# EAGLE design AirU_PoE_V2 (EAGLE 9.5.2)
COMPANY: ADAFRUIT INDUSTRIES; DRAWN: KTOWN; REV: B
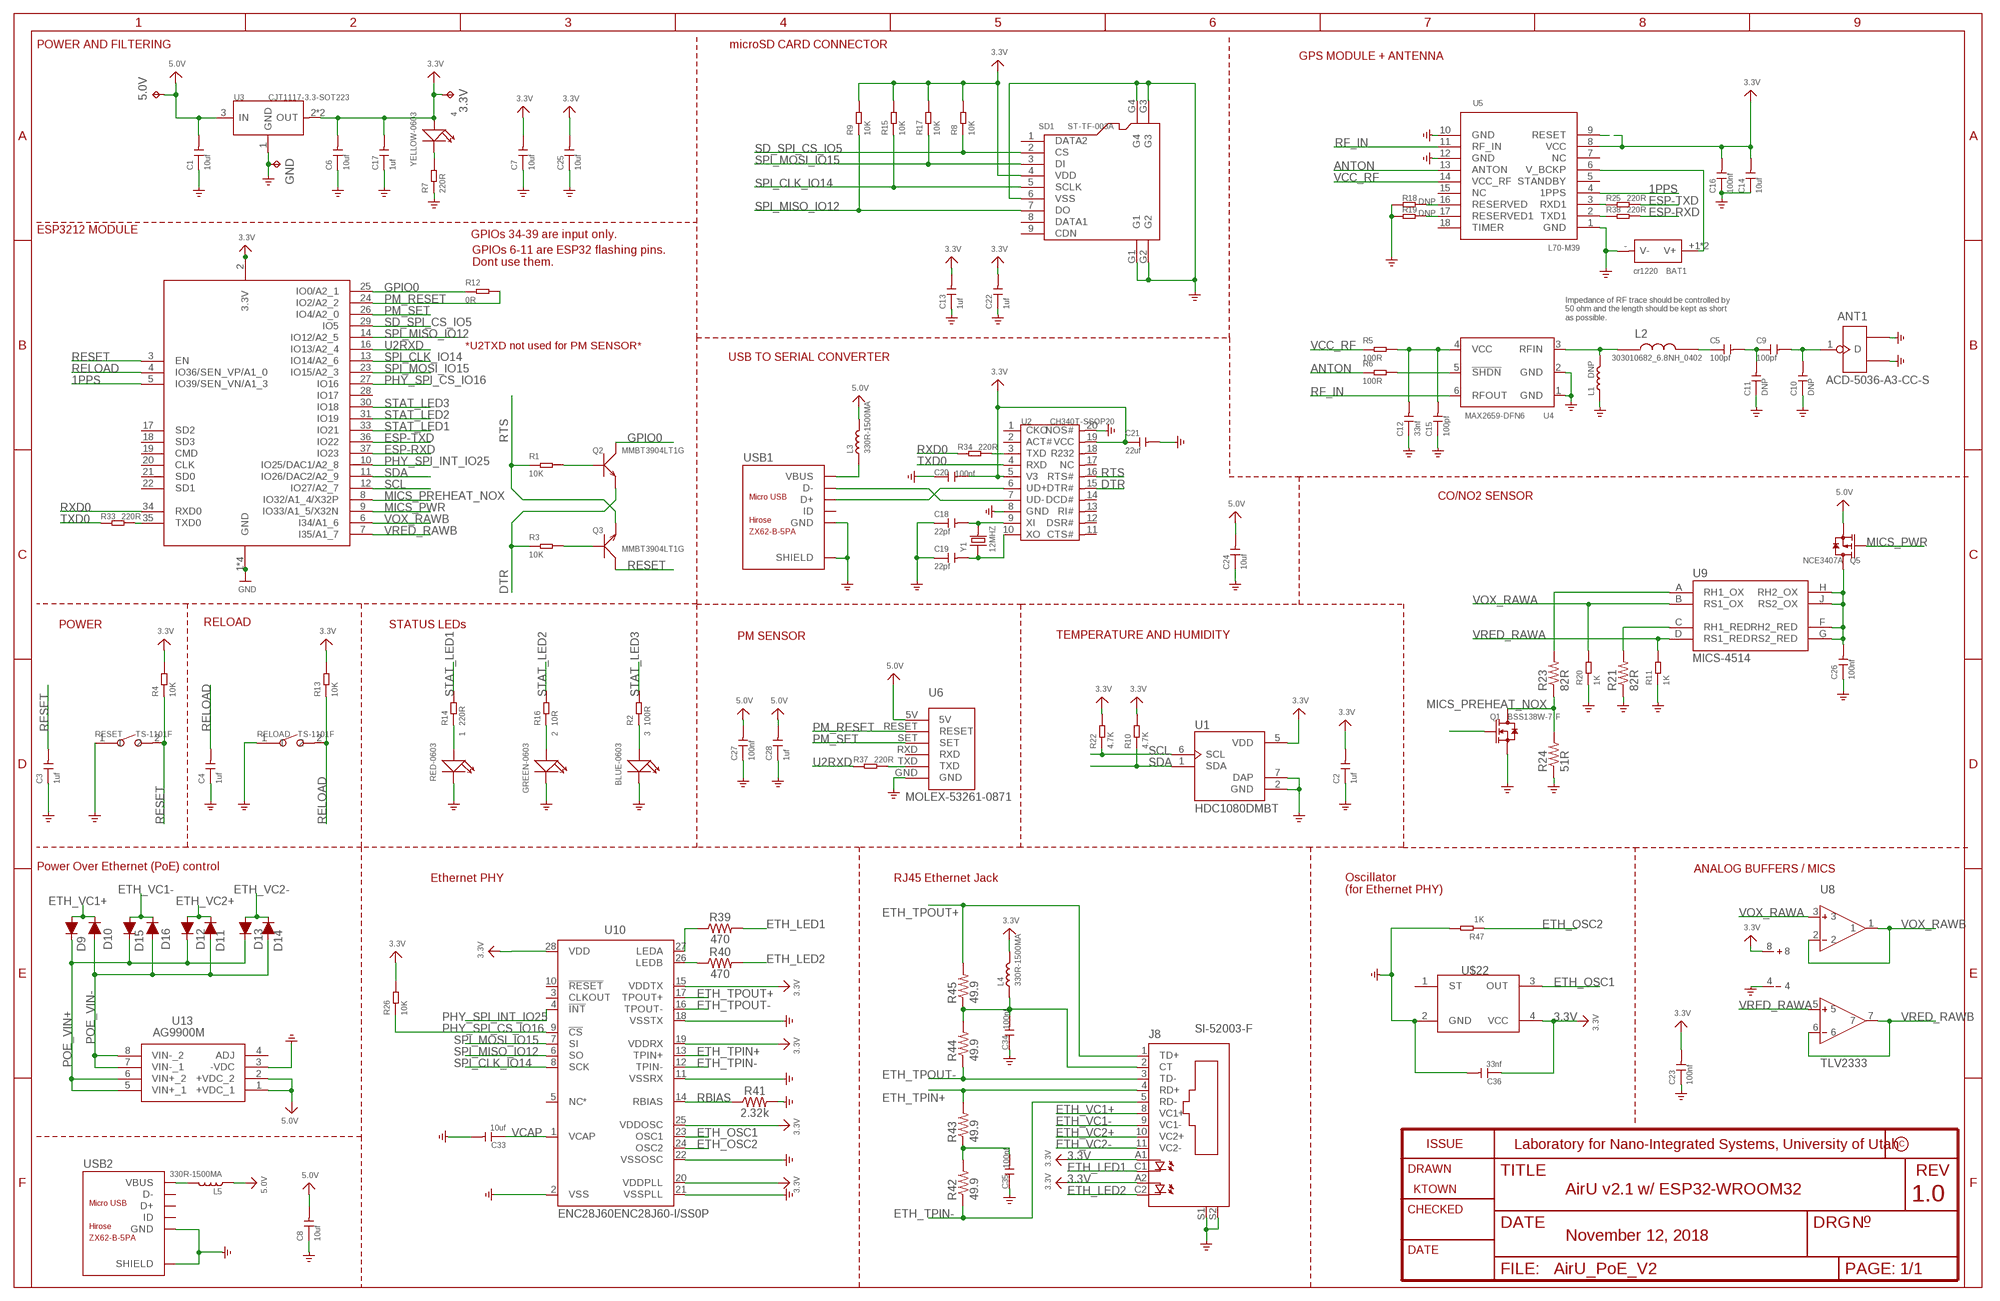
[diagram p0: schematic, sheet 1]
FRAME1 (FRAME_A4): COMPANY: TETRAD: SENSOR NETWORK SOLUTIONS, LLC; REV: 1.0

## Parts
1  RED-0603  LED-SMD-RED-DIFFUSED(0603)  [LED-0603]
2  GREEN-0603  SMD-LED-CLEAR-GREEN(0603)  [LED-0603]
3  BLUE-0603  SMD-LED-CLEAR-BLUE(0603)  [LED-0603]
3.3V  TPTP20SQ  [TP20SQ]
4  YELLOW-0603  SMD-LED-CLEAR-YELLOW(0603)  [LED-0603]
5.0V  TPTP20SQ  [TP20SQ]
ANT1  ACD-5036-A3-CC-S  ANTENNA-ACD5036  [ANT3-SMD-5.2X3.7X0.7MM]
BAT1  cr1220  DIP-BATTERY-CELL-HOLDER(1220)  [BAT2P-13.5-CR1220]
C1  10uf  CERAMIC-10UF-10V-10%-X5R(0603)  [C0603]
C2  1uf  CERAMIC-1UF-25V-10%-X7R(0603)  [C0603]
C3  1uf  CERAMIC-1UF-25V-10%-X7R(0603)  [C0603]
C4  1uf  CERAMIC-1UF-25V-10%-X7R(0603)  [C0603]
C5  100pf  CERAMIC-100PF-50V-5%-NPO(0603)  [C0603]
C6  10uf  CERAMIC-10UF-10V-10%-X5R(0603)  [C0603]
C7  10uf  CERAMIC-10UF-10V-10%-X5R(0603)  [C0603]
C8  10uf  CERAMIC-10UF-10V-10%-X5R(0603)  [C0603]
C9  100pf  CERAMIC-100PF-50V-5%-NPO(0603)  [C0603]
C10  DNP  CERAMIC-100PF-50V-5%-NPO(0603)  [C0603]
C11  DNP  CERAMIC-100PF-50V-5%-NPO(0603)  [C0603]
C12  33nf  CERAMIC-33NF-50V-10%-X7R(0603)  [C0603]
C13  1uf  CERAMIC-1UF-25V-10%-X7R(0603)  [C0603]
C14  10uf  CERAMIC-10UF-10V-10%-X5R(0603)  [C0603]
C15  100pf  CERAMIC-100PF-50V-5%-NPO(0603)  [C0603]
C16  100nf  CERAMIC-100NF-50V-10%-X7R(0603)  [C0603]
C17  1uf  CERAMIC-1UF-25V-10%-X7R(0603)  [C0603]
C18  22pf  CERAMIC-22PF-50V-5%-NPO(0603)  [C0603]
C19  22pf  CERAMIC-22PF-50V-5%-NPO(0603)  [C0603]
C20  100nf  CERAMIC-100NF-50V-10%-X7R(0603)  [C0603]
C21  22uf  CERAMIC-22UF-6.3V-20%-X5R(0805)  [C0805]
C22  1uf  CERAMIC-1UF-25V-10%-X7R(0603)  [C0603]
C23  100nf  CERAMIC-100NF-50V-10%-X7R(0603)  [C0603]
C24  10uf  CERAMIC-10UF-10V-10%-X5R(0603)  [C0603]
C25  10uf  CERAMIC-10UF-10V-10%-X5R(0603)  [C0603]
C26  100nf  CERAMIC-100NF-50V-10%-X7R(0603)  [C0603]
C27  100nf  CERAMIC-100NF-50V-10%-X7R(0603)  [C0603]
C28  1uf  CERAMIC-1UF-25V-10%-X7R(0603)  [C0603]
C33  10uf  CERAMIC-10UF-10V-10%-X5R(0603)  [C0603]
C34  100nf  CERAMIC-100NF-50V-10%-X7R(0603)  [C0603]
C35  100nf  CERAMIC-100NF-50V-10%-X7R(0603)  [C0603]
C36  33nf  CERAMIC-33NF-50V-10%-X7R(0603)  [C0603]
D9  250mA/100V  DIODE-BAS16J  [SOD-323]
D10  250mA/100V  DIODE-BAS16J  [SOD-323]
D11  250mA/100V  DIODE-BAS16J  [SOD-323]
D12  250mA/100V  DIODE-BAS16J  [SOD-323]
D13  250mA/100V  DIODE-BAS16J  [SOD-323]
D14  250mA/100V  DIODE-BAS16J  [SOD-323]
D15  250mA/100V  DIODE-BAS16J  [SOD-323]
D16  250mA/100V  DIODE-BAS16J  [SOD-323]
GND  TPTP20SQ  [TP20SQ]
J8  SI-52003-F  [SI-52003-F]
L1  DNP  INDUCTOR/FERRITE-BEAD-0201  [L0201]
L2  303010682_6.8NH_0402  [L0402]
L3  330R-1500MA  SMD-FERRITE-BEAD-330R-1500MA(0805)'0805'  [L0805]
L4  330R-1500MA  SMD-FERRITE-BEAD-330R-1500MA(0805)'0805'  [L0805]
L5  330R-1500MA  SMD-FERRITE-BEAD-330R-1500MA(0805)'0805'  [L0805]
Q1  BSS138W-7-F  SMD-MOSFET-N-CH-50V-200MA-BSS138W-7-F(SOT-23)  [SOT-23]
Q2  MMBT3904LT1G  SMD-TRANSISTORS-NPN-40V-200MA-MMBT3904LT1G(SOT-23)  [SOT-23]
Q3  MMBT3904LT1G  SMD-TRANSISTORS-NPN-40V-200MA-MMBT3904LT1G(SOT-23)  [SOT-23]
Q5  NCE3407A  SMD-MOSFET-P-CH-VDC=30V-ID=4.3A-NCE3407A(SOT-23)  [SOT-23]
R1  10K  SMD-RES-10K-1%-1/10W(0603)  [R0603]
R2  100R  SMD-RES-100R-5%-1/10W(0603)  [R0603]
R3  10K  SMD-RES-10K-1%-1/10W(0603)  [R0603]
R4  10K  SMD-RES-10K-1%-1/10W(0603)  [R0603]
R5  100R  SMD-RES-100R-5%-1/10W(0603)  [R0603]
R6  100R  SMD-RES-100R-5%-1/10W(0603)  [R0603]
R7  220R  SMD-RES-220R-5%-1/10W(0603)  [R0603]
R8  10K  SMD-RES-10K-1%-1/10W(0603)  [R0603]
R9  10K  SMD-RES-10K-1%-1/10W(0603)  [R0603]
R10  4.7K  SMD-RES-4.7K-5%-1/10W(0603)  [R0603]
R11  1K  SMD-RES-1K-1%-1/10W(0603)  [R0603]
R12  0R  SMD-RES-0R-5%-1/10W(0603)  [R0603]
R13  10K  SMD-RES-10K-1%-1/10W(0603)  [R0603]
R14  220R  SMD-RES-220R-5%-1/10W(0603)  [R0603]
R15  10K  SMD-RES-10K-1%-1/10W(0603)  [R0603]
R16  10R  SMD-RES-10R-5%-1/10W(0603)  [R0603]
R17  10K  SMD-RES-10K-1%-1/10W(0603)  [R0603]
R18  DNP  SMD-RES-10K-1%-1/10W(0603)  [R0603]
R19  DNP  SMD-RES-10K-1%-1/10W(0603)  [R0603]
R20  1K  SMD-RES-1K-1%-1/10W(0603)  [R0603]
R21  82R  R-US_R0603  [R0603]
R22  4.7K  SMD-RES-4.7K-5%-1/10W(0603)  [R0603]
R23  82R  R-US_R0603  [R0603]
R24  51R  R-US_R0603  [R0603]
R25  220R  SMD-RES-220R-5%-1/10W(0603)  [R0603]
R26  10K  SMD-RES-10K-1%-1/10W(0603)  [R0603]
R33  220R  SMD-RES-220R-5%-1/10W(0603)  [R0603]
R34  220R  SMD-RES-220R-5%-1/10W(0603)  [R0603]
R37  220R  SMD-RES-220R-5%-1/10W(0603)  [R0603]
R38  220R  SMD-RES-220R-5%-1/10W(0603)  [R0603]
R39  470  470OHM-0603-1/10W-1%  [0603]
R40  470  470OHM-0603-1/10W-1%  [0603]
R41  2.32k  2.2KOHM-0603-1/10W-1%  [0603]
R42  49.9  R-US_M0805  [M0805]
R43  49.9  R-US_M0805  [M0805]
R44  49.9  R-US_M0805  [M0805]
R45  49.9  R-US_M0805  [M0805]
R47  1K  SMD-RES-1K-1%-1/10W(0603)  [R0603]
RELOAD  TS-1101F  DIP-BUTTON(2P-6.0X3.0X4.3MM)-TS-1101F  [SW2-5.0-6.0X3.0X4.3MM]
RESET  TS-1101F  DIP-BUTTON(2P-6.0X3.0X4.3MM)-TS-1101F  [SW2-5.0-6.0X3.0X4.3MM]
SD1  ST-TF-003A  MICRO-SD-CARD-SOCKET-9P(ST-TF-003A)  [MICRO-SD9+4P-SMD-16.1X14.5X1.85MM]
U1  HDC1080DMBT  [SON100P300X300X80-7N]
U2  CH340T-SSOP20  INTERFACE-CH340T(SSOP20)  [SSOP20-0.65-7.6X5.2MM]
U3  CJT1117-3.3-SOT223  PMIC-CJT1117-3.3(SOT223)  [SOT-223]
U4  MAX2659-DFN6  AMPLIFIER-MAX2659  [DFN6-0.5-1.5X1.2X0.72MM]
U5  L70-M39  MOUDLE-GPS-L70-HARDWARE  [LGA18-1.1-9.7X10.1X2.5MM]
U6  MOLEX-53261-0871  [MOLEX-53261-0871]
U7  ESP32_WROOM32_SKINNY  [WROOM32_SKINNY]
U8  TLV2333  [TLV2333]
U9  MICS-4514  [MICS_10-SMD]
U10  ENC28J60ENC28J60-I/SS0P  [SOP65P780X200-28]
U13  AG9900M  [AG9900M]
U$22  SPXO25MHZ7050-4P  [DFN700X500X150-4N]
USB1  ZX62-B-5PA  MICRO-USB-SMD(ZX62-B-5PA)  [MICRO-USB5+6P-SMD-0.65-AB]
USB2  ZX62-B-5PA  MICRO-USB-SMD(ZX62-B-5PA)  [MICRO-USB5+6P-SMD-0.65-AB]
Y1  12MHZ  SMD-CRYSTAL-12MHZ-20PF-20PPM-40R(2P-5.0X3.2MM)  [X2-SMD-5.0X3.2X1.3MM]

## Nets
1PPS: U5.4(1PPS) U7.5(IO39/SEN_VN/A1_3)
3.3V: 3.3V.TP 4.+ C2.2 C6.2 C7.2 C13.2 C14.2 C16.2 C17.2 C20.2 C21.1 C22.2 C23.2 C25.2 C36.1 J8.A1 J8.A2 L4.2 R4.2 R8.2 R9.2 R10.2 R13.2 R15.2 R17.2 R22.2 R26.2 SD1.4(VDD) U1.5(VDD) U2.5(V3) U2.19(VCC) U3.2(OUT) U3.TER(OUT) U5.8(VCC) U5.9(RESET) U7.2(3.3V) U8.8 U10.15(VDDTX) U10.19(VDDRX) U10.20(VDDPLL) U10.25(VDDOSC) U10.28(VDD) U$22.4(VCC)
5.0V: 5.0V.TP C1.2 C8.2 C24.2 C27.2 C28.2 L3.2 L5.1 Q5.2(S) U3.3(IN) U6.5V U13.1(+VDC_1) U13.2(+VDC_2)
ANTON: R6.1 U5.13(ANTON)
DTR: Q2.2(E) R3.1 U2.15(DTR#)
ESP-RXD: R38.2 U7.37(IO23)
ESP-TXD: R25.2 U7.36(IO22)
ETH_LED1: J8.C1 R39.2
ETH_LED2: J8.C2 R40.2
ETH_OSC1: U10.23(OSC1) U$22.3(OUT)
ETH_OSC2: R47.1 U10.24(OSC2)
ETH_TPIN+: J8.4(RD+) R43.2 U10.13(TPIN+)
ETH_TPIN-: J8.5(RD-) R42.1 U10.12(TPIN-)
ETH_TPOUT+: J8.1(TD+) R45.2 U10.17(TPOUT+)
ETH_TPOUT-: J8.3(TD-) R44.1 U10.16(TPOUT-)
ETH_VC1+: D9.A D10.C J8.8(VC1+)
ETH_VC1-: D15.A D16.C J8.9(VC1-)
ETH_VC2+: D11.C D12.A J8.10(VC2+)
ETH_VC2-: D13.A D14.C J8.11(VC2-)
GND: 1.- 2.- 3.- ANT1.2(GND1) ANT1.3(GND2) BAT1.-(V-) C1.1 C2.1 C3.1 C4.1 C6.1 C7.1 C8.1 C10.1 C11.1 C12.1 C13.1 C14.1 C15.1 C16.1 C17.1 C18.1 C19.1 C20.1 C21.2 C22.1 C23.1 C24.1 C25.1 C26.1 C27.1 C28.1 C33.2 C34.1 C35.1 C36.2 GND.TP J8.S1 J8.S2 L1.1 Q1.2(S) R7.1 R11.1 R18.1 R19.1 R20.1 R21.1 R24.1 R41.2 R47.2 RELOAD.1 RESET.1 SD1.6(VSS) SD1.G1 SD1.G2 SD1.G3 SD1.G4 U1.2(GND) U1.7(DAP) U2.8(GND) U2.20(NOS#) U3.1(GND) U4.1(GND) U4.2(GND) U5.1(GND) U5.10(GND) U5.12(GND) U6.GND U7.1(GND) U7.15(GND) U7.38(GND) U7.P$1(GND) U8.4 U10.2(VSS) U10.11(VSSRX) U10.18(VSSTX) U10.21(VSSPLL) U10.22(VSSOSC) U13.3(-VDC) U$22.2(GND) USB1.5(GND) USB1.P1(SHIELD) USB1.P2(SHIELD) USB1.P3_1(SHIELD) USB1.P3_2(SHIELD) USB1.P3_3(SHIELD) USB1.P4_1(SHIELD) USB1.P4_2(SHIELD) USB1.P4_3(SHIELD) USB1.P5(SHIELD) USB1.P6(SHIELD) USB2.5(GND) USB2.P1(SHIELD) USB2.P2(SHIELD) USB2.P3_1(SHIELD) USB2.P3_2(SHIELD) USB2.P3_3(SHIELD) USB2.P4_1(SHIELD) USB2.P4_2(SHIELD) USB2.P4_3(SHIELD) USB2.P5(SHIELD) USB2.P6(SHIELD) ; supply symbol labelled GND_POWER
GPIO0: Q2.3(C) R12.1 U7.25(IO0/A2_1)
LEDA: R39.1 U10.27(LEDA)
LEDB: R40.1 U10.26(LEDB)
MICS_PREHEAT_NOX: Q1.1(G) U7.8(IO32/A1_4/X32P)
MICS_PWR: Q5.1(G) U7.9(IO33/A1_5/X32N)
N$1: 2.+ R16.1
N$2: R21.2 U9.C(RH1_RED)
N$3: C5.2 C9.1 C11.2
N$4: ANT1.1(D) C9.2 C10.2
N$5: L1.2 L2.P$1 U4.3(RFIN)
N$6: R23.2 U9.A(RH1_OX)
N$7: 1.+ R14.1
N$8: C5.1 L2.P$2
N$9: R6.2 U4.5(!SHDN)
N$10: C12.2 C15.2 R5.2 U4.4(VCC)
N$11: R18.2 U5.16(RESERVED)
N$12: Q3.1(B) R3.2
N$13: Q2.1(B) R1.2
N$14: R19.2 U5.17(RESERVED1)
N$22: 3.+ R2.1
N$23: Q1.3(D) R23.1 R24.2
N$24: C26.2 Q5.3(D) U9.F(RH2_RED) U9.G(RS2_RED) U9.H(RH2_OX) U9.J(RS2_OX)
N$25: 4.- R7.2
N$26: U2.7(UD-) USB1.2(D-)
N$27: U2.6(UD+) USB1.3(D+)
N$28: C18.2 U2.9(XI) Y1.2
N$29: C19.2 U2.10(XO) Y1.1
N$30: R34.2 U2.3(TXD)
N$33: R33.2 U7.35(TXD0)
N$36: R37.2 U6.TXD
N$43: C35.2 R42.2 R43.1
N$46: C34.2 J8.2(CT) L4.1 R44.2 R45.1
PHY_SPI_CS_IO16: R26.1 U7.27(IO16) U10.9(!CS)
PHY_SPI_INT_IO25: U7.10(IO25/DAC1/A2_8) U10.4(!INT)
PM_RESET: R12.2 U6.RESET U7.24(IO2/A2_2)
PM_SET: U6.SET U7.26(IO4/A2_0)
POE_VIN+: D9.C D12.C D13.C D15.C U13.5(VIN+_1) U13.6(VIN+_2)
POE_VIN-: D10.A D11.A D14.A D16.A U13.7(VIN-_1) U13.8(VIN-_2)
RBIAS: R41.1 U10.14(RBIAS)
RELOAD: C4.2 R13.1 RELOAD.2 U7.4(IO36/SEN_VP/A1_0)
RESET: C3.2 Q3.3(C) R4.1 RESET.2 U7.3(EN)
RF_IN: U4.6(RFOUT) U5.11(RF_IN)
RTS: Q3.2(E) R1.1 U2.16(RTS#)
RXD0: R34.1 U7.34(RXD0)
SCL: R22.1 U1.6(SCL) U7.12(IO27/A2_7)
SD_SPI_CS_IO5: R8.1 SD1.2(CS) U7.29(IO5)
SDA: R10.1 U1.1(SDA) U7.11(IO26/DAC2/A2_9)
SPI_CLK_IO14: R15.1 SD1.5(SCLK) U7.13(IO14/A2_6) U10.8(SCK)
SPI_MISO_IO12: R9.1 SD1.7(DO) U7.14(IO12/A2_5) U10.6(SO)
SPI_MOSI_IO15: R17.1 SD1.3(DI) U7.23(IO15/A2_3) U10.7(SI)
STAT_LED1: R14.2 U7.33(IO21)
STAT_LED2: R16.2 U7.31(IO19)
STAT_LED3: R2.2 U7.30(IO18)
TXD0: R33.1 U2.4(RXD)
U1RXD: R25.1 U5.3(RXD1)
U1TXD: R38.1 U5.2(TXD1)
U2RXD: R37.1 U7.16(IO13/A2_4)
V_BCKP: BAT1.+1(V+) BAT1.+2(V+) U5.6(V_BCKP)
VBUS: L3.1 L5.2 USB1.1(VBUS) USB2.1(VBUS)
VCAP: C33.1 U10.1(VCAP)
VCC_RF: R5.1 U5.14(VCC_RF)
VOX_RAWA: R20.2 U8.3 U9.B(RS1_OX)
VOX_RAWB: U7.6(I34/A1_6) U8.1 U8.2
VRED_RAWA: R11.2 U8.5 U9.D(RS1_RED)
VRED_RAWB: U7.7(I35/A1_7) U8.6 U8.7
Unconnected: SD1.1(DATA2) SD1.8(DATA1) SD1.9(CDN) U2.1(CKO) U2.2(ACT#) U2.11(CTS#) U2.12(DSR#) U2.13(RI#) U2.14(DCD#) U2.17(NC) U2.18(R232) U5.5(STANDBY) U5.7(NC) U5.15(NC) U5.18(TIMER) U6.RXD U7.17(SD2) U7.18(SD3) U7.19(CMD) U7.20(CLK) U7.21(SD0) U7.22(SD1) U7.28(IO17) U10.3(CLKOUT) U10.5(NC*) U10.10(!RESET) U13.4(ADJ) U$22.1(ST) USB1.4(ID) USB2.2(D-) USB2.3(D+) USB2.4(ID)

## Notes on the sheet
- POWER AND FILTERING | microSD CARD CONNECTOR
- GPS MODULE + ANTENNA
- ESP3212 MODULE
- GPIOs 34-39 are input only.
- GPIOs 6-11 are ESP32 flashing pins.
  Dont use them.
- Impedance of RF trace should be controlled by 
  50 ohm and the length should be kept as short 
  as possible.
- *U2TXD not used for PM SENSOR*
- USB TO SERIAL CONVERTER
- CO/NO2 SENSOR
- POWER | RELOAD | STATUS LEDs
- PM SENSOR | TEMPERATURE AND HUMIDITY
- Power Over Ethernet (PoE) control | ANALOG BUFFERS / MICS
- Ethernet PHY | RJ45 Ethernet Jack
- Oscillator
  (for Ethernet PHY)
- Laboratory for Nano-Integrated Systems, University of Utah
- AirU v2.1 w/ ESP32-WROOM32
- November 12, 2018

## Library data of the parts
1 = Seeed-LED:LED-SMD-RED-DIFFUSED(0603): 304090042; MPN: 19-217-R6C-AL1M2VY-3T
2 = Seeed-LED:SMD-LED-CLEAR-GREEN(0603): 304090043; MPN: 19-217-G7C-AN1P2-3T
3 = Seeed-LED:SMD-LED-CLEAR-BLUE(0603): 304090045; MPN: 19-217-BHC-ZL1M2RY-3T
3.3V 5.0V GND = testpad:TP: Test pad
4 = Seeed-LED:SMD-LED-CLEAR-YELLOW(0603): 304090044; MPN: 19-217-Y5C-AM1N1VY-3T
ANT1 = Connector-new:ANTENNA-ACD5036; MPN: ACD-5036-A3-CC-S
BAT1 = Seeed-Connector:DIP-BATTERY-CELL-HOLDER(1220): 320170002
C1 C6-C8 C14 C24 C25 C33 = Seeed-Capacitor:CERAMIC-10UF-10V-10%-X5R(0603): 302010103; MPN: CC0603KRX5R6BB106
C2-C4 C13 C17 C22 C28 = Seeed-Capacitor:CERAMIC-1UF-25V-10%-X7R(0603): 302010139; MPN: CC0603KRX7R8BB105
C5 C9 C15 = Seeed-Capacitor:CERAMIC-100PF-50V-5%-NPO(0603): 302010076; MPN: CC0603JRNPO9BN101
C10 C11 = Seeed-Capacitor:CERAMIC-100PF-50V-5%-NPO(0603): 302010076; MPN: CC0603JRNPO9BN101; VALUE: 100pf
C12 C36 = Seeed-Capacitor:CERAMIC-33NF-50V-10%-X7R(0603): 302010088; MPN: CC0603KRX7R9BB333
C16 C20 C23 C26 C27 C34 C35 = Seeed-Capacitor:CERAMIC-100NF-50V-10%-X7R(0603): 302010138; MPN: CC0603KRX7R9BB104
C18 C19 = Seeed-Capacitor:CERAMIC-22PF-50V-5%-NPO(0603): 302010143; MPN: CC0603JRNPO9BN220
C21 = Seeed-Capacitor:CERAMIC-22UF-6.3V-20%-X5R(0805): 302010171; MPN: CC0805MKX5R5BB226
D9-D16 = SparkFun-DiscreteSemi:DIODE: Diode These are standard reverse protection diodes and small signal diodes. SparkFun Products: SparkFun SparkPunk Sound Kit <https://www.sparkfun.com/products/11177> SparkFun ESP8266 Thing <https://www.sparkfun.com/products/13231>; PROD_ID: DIO-09646
J8 = SI-52003-F:SI-52003-F: Ethernet Connector MagJack (R) Source: www.stewartconnector.com .. si-50170.pdf; AVAILABILITY: Unavailable; DESCRIPTION: Conn RJ-45 F 8 POS Solder RA Thru-Hole 12 Terminal 1 Port; MF: Stewart Connector; MP: SI-52003-F; PACKAGE: None; PRICE: None
L1 = Discrete-new:INDUCTOR/FERRITE-BEAD
L2 = Seeed-OPL-2017-01-Inductor-Akita:303010682_6.8NH_0402: Murata;LQW15AN6N8G00D, SMD Inductor 6.8nH-2%-700mA;0402, SKU: 303010682
L3-L5 = Seeed-Inductor:SMD-FERRITE-BEAD-330R-1500MA(0805): 303030006; MPN: BLM21PG331SN1D
Q1 = Seeed-Transistor:SMD-MOSFET-N-CH-50V-200MA-BSS138W-7-F(SOT-23): 305030000; MPN: BSS138W-7-F
Q2 Q3 = Seeed-Transistor:SMD-TRANSISTORS-NPN-40V-200MA-MMBT3904LT1G(SOT-23): 305010013; MPN: MMBT3904LT1G
Q5 = Seeed-Transistor:SMD-MOSFET-P-CH-VDC=30V-ID=4.3A-NCE3407A(SOT-23): 305030010; MPN: NCE3407A
R1 R3 R4 R8 R9 R13 R15 R17 R26 = Seeed-Resistor:SMD-RES-10K-1%-1/10W(0603): 301010299; MPN: RC0603FR-0710KL
R2 R5 R6 = Seeed-Resistor:SMD-RES-100R-5%-1/10W(0603): 301010090; MPN: RC0603JR-07100RL
R7 R14 R25 R33 R34 R37 R38 = Seeed-Resistor:SMD-RES-220R-5%-1/10W(0603): 301010163; MPN: RC0603JR-07220RL
R10 R22 = Seeed-Resistor:SMD-RES-4.7K-5%-1/10W(0603): 301010290; MPN: RC0603JR-074K7L
R11 R20 R47 = Seeed-Resistor:SMD-RES-1K-1%-1/10W(0603): 301010298; MPN: RC0603FR-071KL
R12 = Seeed-Resistor:SMD-RES-0R-5%-1/10W(0603): 301010292; MPN: RC0603JR-070RL
R16 = Seeed-Resistor:SMD-RES-10R-5%-1/10W(0603): 301010096; MPN: RC0603JR-0710RL
R18 R19 = Seeed-Resistor:SMD-RES-10K-1%-1/10W(0603): 301010299; MPN: RC0603FR-0710KL; VALUE: 10K
R21 R23 R24 = rcl:R-US_: RESISTOR, American symbol; SPICEPREFIX: R
R39 R40 = SparkFun-Resistors:470OHM: 470Ω resistor A resistor is a passive two-terminal electrical component that implements electrical resistance as a circuit element. Resistors act to reduce current flow, and, at the same time, act to lower voltage levels within circuits. - Wikipedia; PROD_ID: RES-07869
R41 = SparkFun-Resistors:2.2KOHM: 2.2kΩ resistor A resistor is a passive two-terminal electrical component that implements electrical resistance as a circuit element. Resistors act to reduce current flow, and, at the same time, act to lower voltage levels within circuits. - Wikipedia; PROD_ID: RES-08272; VALUE: 2.2k
R42-R45 = BeagleBone_Black_Wireless:R-US_: RESISTOR, American symbol
RELOAD RESET = OPL_Switch:DIP-BUTTON(2P-6.0X3.0X4.3MM): 311020025; MPN: TS-1101F
SD1 = Seeed-Connector:MICRO-SD-CARD-SOCKET-9P(ST-TF-003A): 320090000; MPN: ST-TF-003A
U1 = HDC1080DMBT_TITempHum:HDC1080DMBT: HDC1080 Low Power, High Accuracy Digital Humidity Sensor with Temperature Sensor 6-WSON -40 to 125; DESCRIPTION: HDC1080 Low Power, High Accuracy Digital Humidity Sensor with Temperature Sensor 6-WSON -40 to 125; DIGI-KEY_PART_NUMBER: 296-43864-1-ND; DIGI-KEY_PURCHASE_URL: https://www.digikey.com/product-detail/en/texas-instruments/HDC1080DMBT/296-43864-1-ND/5878615?utm_source=snapeda&utm_medium=aggregator&utm_campaign=symbol; MF: Texas Instruments; MP: HDC1080DMBT; PACKAGE: WDFN-6 Texas Instruments
U2 = Seeed-IC:INTERFACE-CH340T(SSOP20): 310070026; MPN: CH340T
U3 = Seeed-IC:PMIC-CJT1117-3.3(SOT223): 310030097; MPN: CJT1117-3.3
U4 = IC-new:AMPLIFIER-MAX2659: GPS/GNSS Low-Noise Amplifier; MPN: MAX2659
U5 = moudle-new:MOUDLE-GPS-L70-HARDWARE: L70 GPS module; MPN: L70; VALUE: L70
U6 = Molex_53261_0871_Connector:MOLEX-53261-0871
U7 = microbuilder:ESP32_WROOM32
U8 = tlv2333:TLV2333
U9 = MICS-4514:MICS-4514: Metal oxide MEMS carbon monoxide (CO) and NOx sensor in an SMD package.; AVAILABILITY: Unavailable; MF: Amphenol; MP: MICS-4514; PACKAGE: None; PRICE: 11.82 USD
U10 = ENC28J60QFN:ENC28J60: Stand-Alone Ethernet Controller with SPI Interface Source: http://ww1.microchip.com/downloads/en/DeviceDoc/39662c.pdf
U13 = Ag9900M:AG9900M: Ultra Miniature PoE Module Source: Datasheet <https://www.silvertel.com/images/datasheets/Ag9900M-datasheet-ultra-miniature-isolated-Power-over-Ethernet-POE-module.pdf>; DESCRIPTION: Ultra Miniature PoE Module; HEIGHT: 13mm; MANUFACTURER_NAME: Silvertel; MANUFACTURER_PART_NUMBER: Ag9900M
U$22 = 25MHZ_seeed:SPXO25MHZ7050-4P
USB1 USB2 = Seeed-Connector:MICRO-USB-SMD(ZX62-B-5PA): 320010005; MPN: ZX62-B-5PA
Y1 = Seeed-Crystal Oscillator:SMD-CRYSTAL-12MHZ-20PF-20PPM-40R(2P-5.0X3.2MM): 306010047; MPN: 5032/2P

## Board
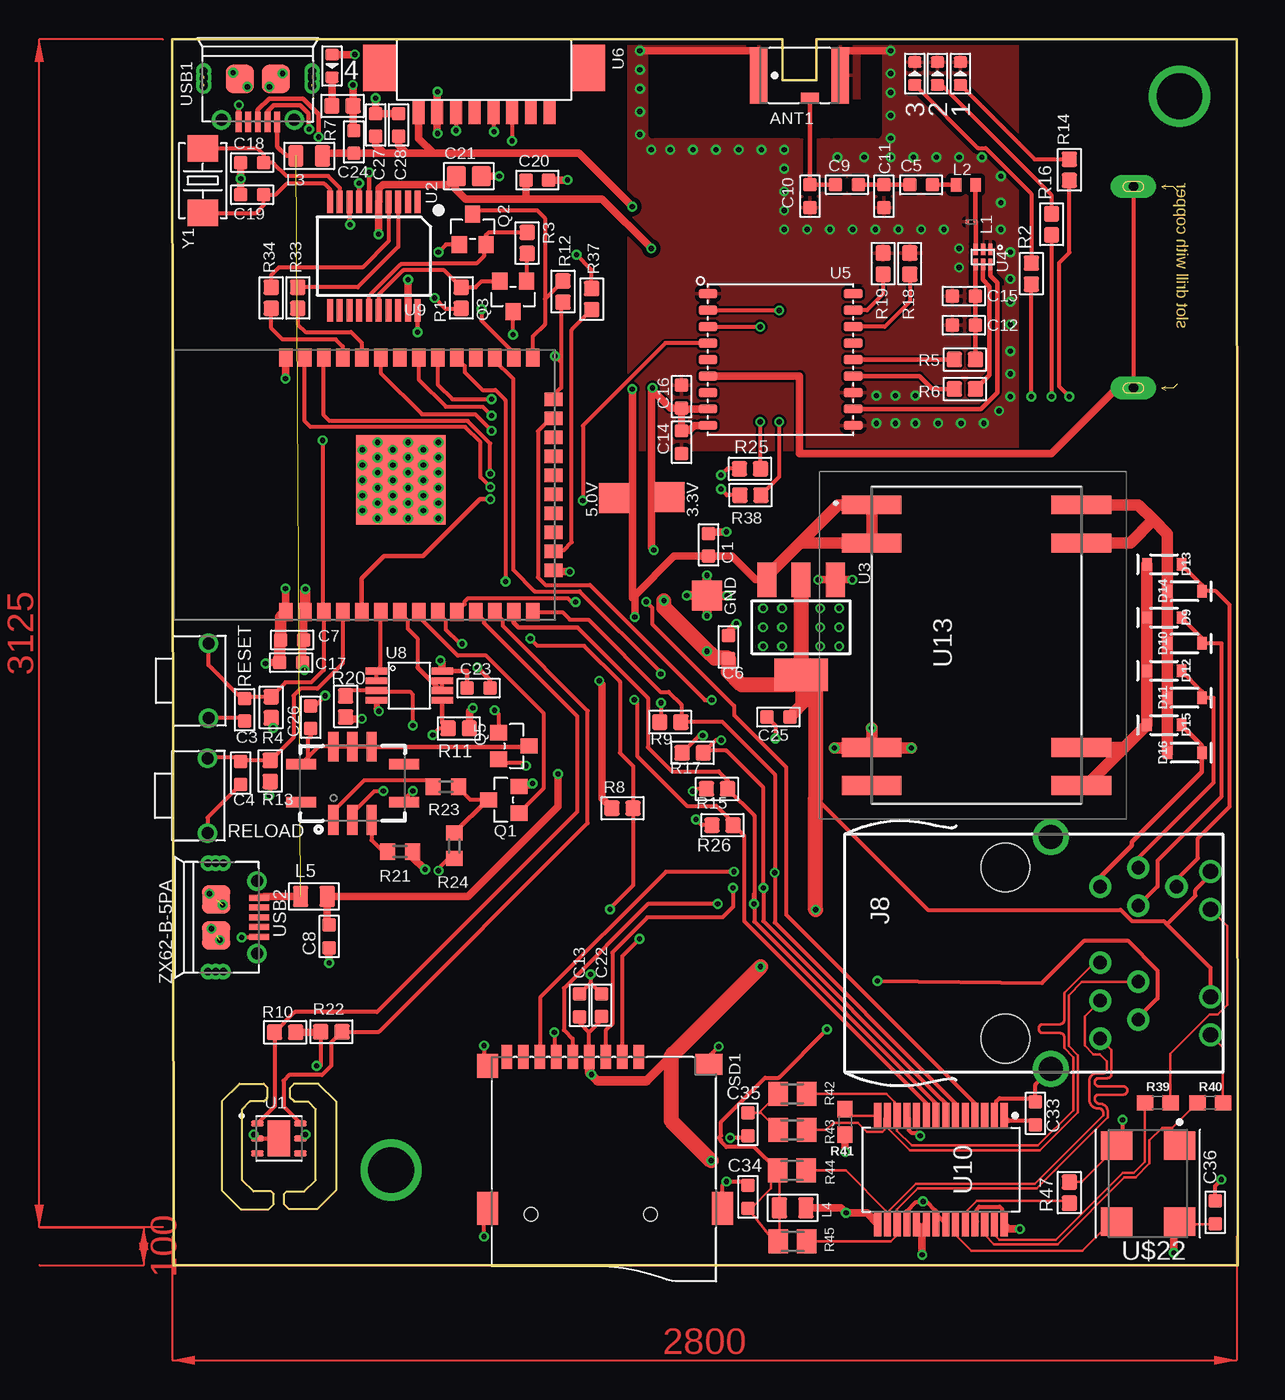
[diagram p1: board, top side]
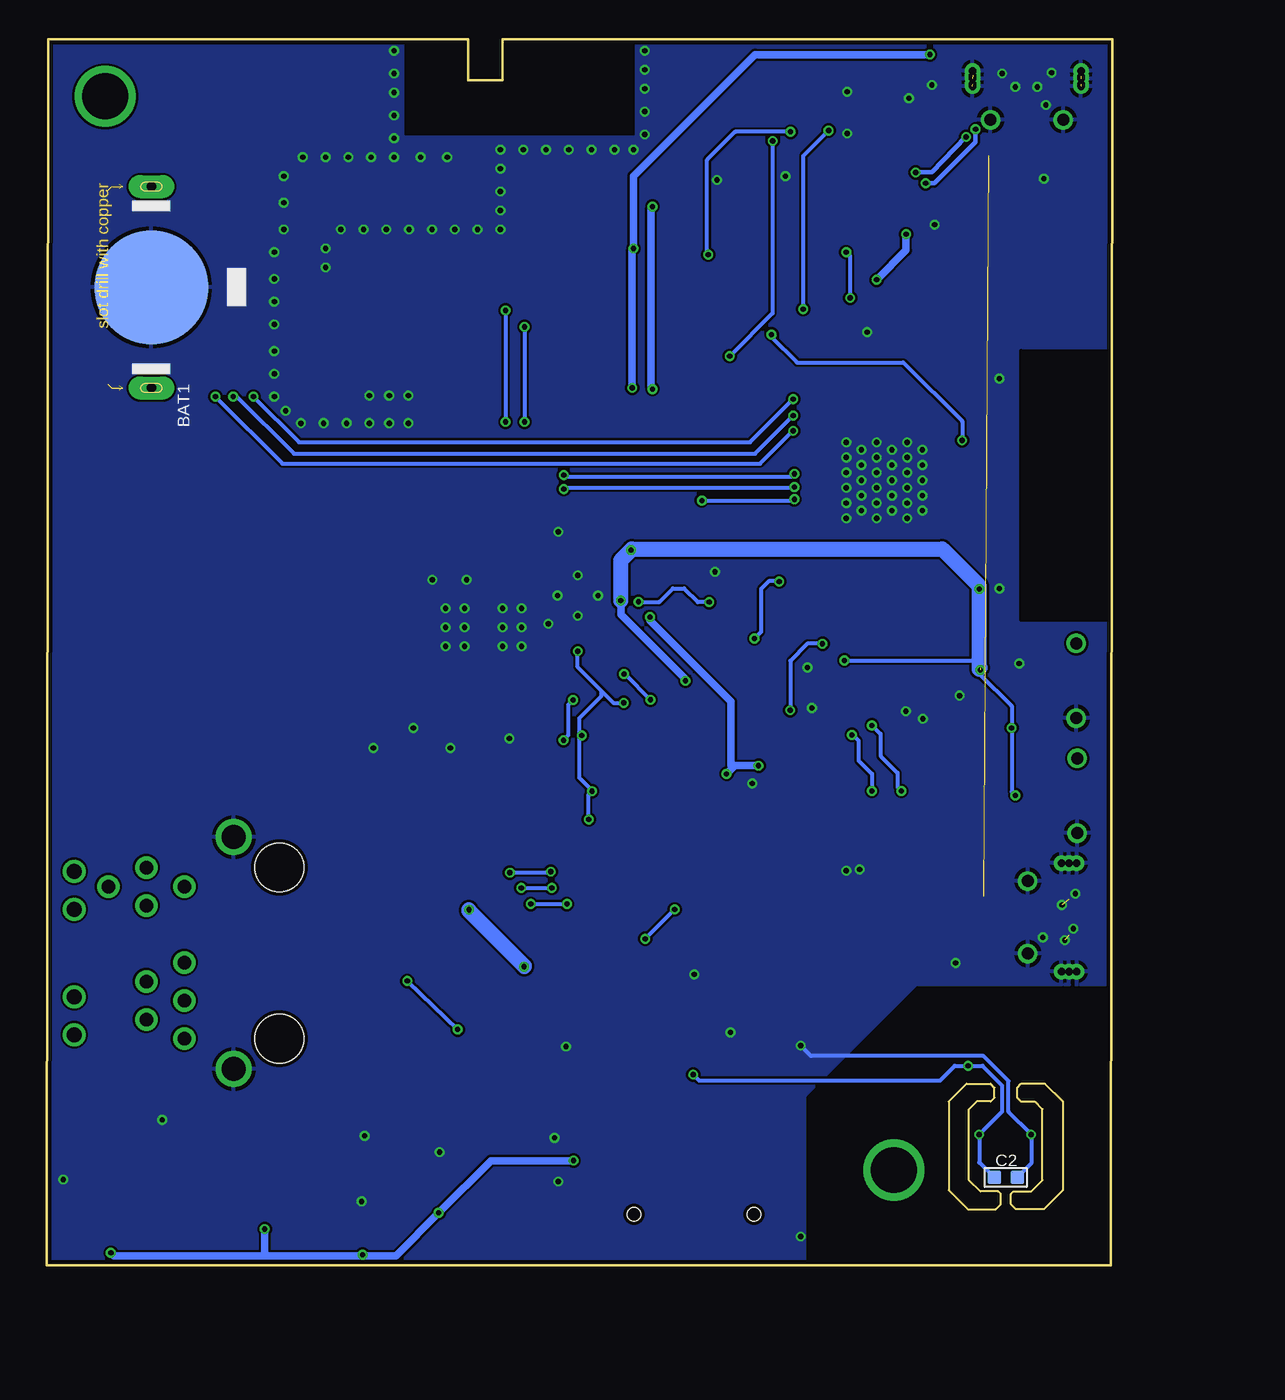
[diagram p2: board, bottom side, seen from below]

Size 71.2 x 81.91 mm. Coordinates in mm from the lower left corner, seen from the top.
Outline: 0,81.91 0.09,0 71.2,0 71.12,81.91 43.05,81.91 43.05,79.18 40.77,79.18 40.77,81.91 0,81.91
Outline: 6.78,4.07 6.78,4.75 6.61,4.92 5.42,4.92 4.66,5.68 4.66,10.42 5.17,10.93 6.1,10.93 6.36,11.18 6.36,11.86 6.1,12.11 4.49,12.11 3.31,10.93 3.31,5 4.58,3.73 6.44,3.73 6.78,4.07
Outline: 7.46,4.07 7.46,4.75 7.63,4.92 8.81,4.92 9.57,5.68 9.57,10.42 9.06,10.93 8.13,10.93 7.88,11.18 7.88,11.86 8.13,12.11 9.74,12.11 10.93,10.93 10.93,5 9.66,3.73 7.8,3.73 7.46,4.07
Copper layers (1*16): Top 0.035mm / dielectric 1.5mm / Bottom 0.035mm
Design rules "SeeedStudio_2layer_DRU_no_angle_20140221": minimum track width 6mil, minimum drill 12mil, track to track 6mil, track to pad 6mil, pad to pad 6mil, via to via 6mil, smd to smd 0mil, copper to edge 10mil, drill to drill 10mil, minimum pad ring 10mil, minimum via ring 6mil, stop-mask expansion 2mil, vias tented up to drill 100mil, thermal gap 10mil
tRestrict: area 0.1,43.1 to 6.1,61.1
bRestrict: area 0.1,43.1 to 6.1,61.1; area 32.1,75.6 to 47.1,81.9; area 32,75.6 to 47.2,81.9

### Footprints (pad centres in the part's own frame; a part is rotated, then mirrored left to right if it is on the bottom)
LED-0603 = smd 0.762 x 0.889: + -0.762,0; - 0.762,0
TP20SQ = smd 2 x 2: TP 0,0
ANT3-SMD-5.2X3.7X0.7MM = smd 0.75 x 1.2: 1 1.525,0.7 | smd 3.8 x 1.15: 2 0,2.725; 3 0,-2.725
BAT2P-13.5-CR1220 = drill 0.635 pad 1.524 long: +1 6.731,0; +2 -6.731,0 | smd 7.62 x 7.62: - 0,0
C0603 = smd 0.889 x 0.889: 1 0,0.762; 2 0,-0.762
C0805 = smd 1.397 x 1.27: 1 0,0.835; 2 0,-0.835
SOD-323 = smd 0.63 x 0.83: A 1.15,0; C -1.15,0
SI-52003-F = drill 0.9 pad 1.5: 1 5.715,3.302; 2 4.445,5.842; 3 3.175,3.302; 4 1.905,5.842; 5 0.635,3.302; 8 -3.175,5.842; 9 -4.445,3.302; 10 -5.715,5.842; 11 -4.445,8.382 | drill 1.016 pad 1.5: A1 -5.461,10.668; A2 2.921,10.668; C1 -2.921,10.668; C2 5.461,10.668 | drill 1.6 pad 2.2: S1 -7.747,0; S2 7.747,0 | hole 3.251: -5.715,-3.048; 5.715,-3.048
L0201 = smd 0.279 x 0.318: 1 -0.279,0; 2 0.279,0
L0402 = smd 0.7 x 0.9: P$1 -0.65,0; P$2 0.65,0
L0805 = smd 1.016 x 1.397: 1 -0.889,0; 2 0.889,0
SOT-23 = smd 1.016 x 1.143: 1 -0.889,-1.016; 2 0.889,-1.016; 3 0,1.016
R0603 = smd 1.016 x 1.016: 1 0,0.708; 2 0,-0.708
R0603' = smd 1 x 1.1: 1 -0.85,0; 2 0.85,0
0603 = smd 1.1 x 1: 1 -0.85,0; 2 0.85,0
M0805 = smd 1.3 x 1.6: 1 -0.95,0; 2 0.95,0
SW2-5.0-6.0X3.0X4.3MM = drill 0.8 pad 1.27: 1 -2.5,0; 2 2.5,0
MICRO-SD9+4P-SMD-16.1X14.5X1.85MM = smd 1.6 x 0.7: 1 0,2.25; 2 0,1.15; 3 0,0.05; 4 0,-1.05; 5 0,-2.15; 6 0,-3.25; 7 0,-4.35; 8 0,-5.45; 9 0,-6.55 | smd 1.6 x 1.4: G1 0.6,-7.85 | smd 2.2 x 1.4: G2 10.1,-7.85; G3 10.1,7.85 | smd 1.4 x 1.8: G4 0.5,6.95 | hole 0.9: 10.5,-4.95; 10.5,3.05
SON100P300X300X80-7N = smd 0.86 x 0.42: 1 -1.435,1; 2 -1.435,0; 3 -1.435,-1; 4 1.435,-1; 5 1.435,0; 6 1.435,1 | smd 1.5 x 2.4: 7 0,0
SSOP20-0.65-7.6X5.2MM = smd 0.4 x 1.5: 1 -2.925,-3.625; 2 -2.275,-3.625; 3 -1.625,-3.625; 4 -0.975,-3.625; 5 -0.325,-3.625; 6 0.325,-3.625; 7 0.975,-3.625; 8 1.625,-3.625; 9 2.275,-3.625; 10 2.925,-3.625; 11 2.925,3.625; 12 2.275,3.625; 13 1.625,3.625; 14 0.975,3.625; 15 0.325,3.625; 16 -0.325,3.625; 17 -0.975,3.625; 18 -1.625,3.625; 19 -2.275,3.625; 20 -2.925,3.625
SOT-223 = smd 1.27 x 2.286: 1 -2.286,-3.175; 2 0,-3.175; 3 2.286,-3.175 | smd 3.556 x 2.159: TER 0,3.175
DFN6-0.5-1.5X1.2X0.72MM = smd 0.3 x 0.75: 1 -0.5,-0.5; 2 0,-0.5; 3 0.5,-0.5; 4 0.5,0.5; 5 0,0.5; 6 -0.5,0.5
LGA18-1.1-9.7X10.1X2.5MM = smd 1.27 x 0.635: 1 4.85,-4.4; 2 4.85,-3.3; 3 4.85,-2.2; 4 4.85,-1.1; 5 4.85,0; 6 4.85,1.1; 7 4.85,2.2; 8 4.85,3.3; 9 4.85,4.4; 10 -4.85,4.4; 11 -4.85,3.3; 12 -4.85,2.2; 13 -4.85,1.1; 14 -4.85,0; 15 -4.85,-1.1; 16 -4.85,-2.2; 17 -4.85,-3.3; 18 -4.85,-4.4
MOLEX-53261-0871 = smd 0.8 x 1.6: 5V 4.375,0.8; GND 3.125,0.8; NC@1 -4.375,0.8; NC@2 -3.125,0.8; RESET -1.875,0.8; RXD 0.625,0.8; SET 1.875,0.8; TXD -0.625,0.8 | smd 2.2 x 3.1: NC@3 -6.975,-2.16; NC@4 6.975,-2.16
WROOM32_SKINNY = smd 1.2 x 0.9: 1 -8.5,5; 2 -8.5,3.73; 3 -8.5,2.46; 4 -8.5,1.19; 5 -8.5,-0.08; 6 -8.5,-1.35; 7 -8.5,-2.62; 8 -8.5,-3.89; 9 -8.5,-5.16; 10 -8.5,-6.43; 11 -8.5,-7.7; 12 -8.5,-8.97; 13 -8.5,-10.24; 14 -8.5,-11.51; 25 8.5,-11.51; 26 8.5,-10.24; 27 8.5,-8.97; 28 8.5,-7.7; 29 8.5,-6.43; 30 8.5,-5.16; 31 8.5,-3.89; 32 8.5,-2.62; 33 8.5,-1.35; 34 8.5,-0.08; 35 8.5,1.19; 36 8.5,2.46; 37 8.5,3.73; 38 8.5,5 | smd 0.9 x 1.2: 15 -5.7,-12.9; 16 -4.43,-12.9; 17 -3.16,-12.9; 18 -1.89,-12.9; 19 -0.62,-12.9; 20 0.65,-12.9; 21 1.92,-12.9; 22 3.19,-12.9; 23 4.46,-12.9; 24 5.73,-12.9 | smd 6 x 6: P$1 0.34,-2.7
TLV2333 = smd 1.45 x 0.45: 1 0.725,2.175; 2 0.725,1.525; 3 0.725,0.875; 4 0.725,0.225; 5 5.125,0.225; 6 5.125,0.875; 7 5.125,1.525; 8 5.125,2.175
MICS_10-SMD = smd 0.7 x 2: A 1.27,2.45; B 0,2.45; C -1.27,2.45; F -1.27,-2.45; G 0,-2.45; H 1.27,-2.45 | smd 2 x 0.7: D -3.45,1.27; E -3.45,-1.27; J 3.45,-1.27; K 3.45,1.27
SOP65P780X200-28 = smd 1.702 x 0.475: 1 -3.603,4.225; 2 -3.603,3.575; 3 -3.603,2.925; 4 -3.603,2.275; 5 -3.603,1.625; 6 -3.603,0.975; 7 -3.603,0.325; 8 -3.603,-0.325; 9 -3.603,-0.975; 10 -3.603,-1.625; 11 -3.603,-2.275; 12 -3.603,-2.925; 13 -3.603,-3.575; 14 -3.603,-4.225; 15 3.603,-4.225; 16 3.603,-3.575; 17 3.603,-2.925; 18 3.603,-2.275; 19 3.603,-1.625; 20 3.603,-0.975; 21 3.603,-0.325; 22 3.603,0.325; 23 3.603,0.975; 24 3.603,1.625; 25 3.603,2.275; 26 3.603,2.925; 27 3.603,3.575; 28 3.603,4.225
AG9900M = smd 1.25 x 4: 1 -9.375,-7; 2 -6.835,-7; 3 6.835,-7; 4 9.375,-7; 5 9.375,7; 6 6.835,7; 7 -6.835,7; 8 -9.375,7
DFN700X500X150-4N = smd 1.912 x 2.112: 1 -2.54,2.1; 2 -2.54,-2.1; 3 2.54,-2.1; 4 2.54,2.1
MICRO-USB5+6P-SMD-0.65-AB = smd 0.4 x 1.35: 1 -1.3,2.875; 2 -0.65,2.875; 3 0,2.875; 4 0.65,2.875; 5 1.3,2.875 | smd 1.9 x 1.9: P1 -1.2,0; P2 1.2,0 | drill 0.508 pad 1.016: P3_1 -3.625,-0.533; P3_2 -3.625,-0.025; P3_3 -3.625,0.483; P4_1 3.625,-0.533; P4_2 3.625,-0.025; P4_3 3.625,0.483 | drill 0.8: P5 -2.425,2.73; P6 2.425,2.73
X2-SMD-5.0X3.2X1.3MM = smd 1.778 x 2.032: 1 -2.159,0; 2 2.159,0

### Placement (x,y rotation side)
1  52.66,79.63 90 top
2  51.14,79.63 90 top
3  49.61,79.63 90 top
3.3V  33.21,51.33 270 top
4  10.67,80.14 270 top
5.0V  29.52,51.27 270 top
ANT1  41.91,79.5 270 top
BAT1  64.22,65.34 270 bottom
C1  35.84,48.13 0 top
C2  7.13,5.85 270 bottom
C3  4.82,37.12 180 top
C4  4.57,32.89 180 top
C5  50.04,72.2 270 top
C6  37.15,41.32 0 top
C7  8,41.78 90 top
C8  10.48,21.97 180 top
C9  45.09,72.2 270 top
C10  42.61,71.44 180 top
C11  47.56,71.44 180 top
C12  52.9,62.8 90 top
C13  27.2,17.36 0 top
C14  34.04,54.99 180 top
C15  52.9,64.77 90 top
C16  34.04,58.04 0 top
C17  7.94,40.26 90 top
C18  5.33,73.68 90 top
C19  5.33,71.52 90 top
C20  24.38,72.52 270 top
C21  19.81,72.77 90 top
C22  28.68,17.38 0 top
C23  20.47,38.57 270 top
C24  12.13,75.06 0 top
C25  40.49,36.63 90 top
C26  9.25,36.62 0 top
C27  13.59,76.2 0 top
C28  15.11,76.2 0 top
C33  57.67,10.14 180 top
C34  38.47,4.56 0 top
C35  38.47,9.4 180 top
C36  69.69,3.53 180 top
D9  66.28,43.28 0 top
D10  67.66,41.54 180 top
D11  67.66,37.92 180 top
D12  66.28,39.72 0 top
D13  66.28,46.83 0 top
D14  67.66,45.03 180 top
D15  66.28,36.1 0 top
D16  67.66,34.24 180 top
GND  35.73,44.75 270 top
J8  58.71,20.85 270 top
L1  53.4,69.72 0 top
L2  53.02,72.2 180 top
L3  9.14,74.13 0 top
L4  41.45,3.83 0 top
L5  9.46,24.64 180 top
Q1  22.14,31.09 90 top
Q2  20.07,69.21 0 top
Q3  22.77,64.73 180 top
Q5  22.82,34.69 270 top
R1  19.3,64.64 0 top
R2  57.4,66.25 0 top
R3  23.71,68.3 0 top
R4  6.6,37.27 0 top
R5  52.96,60.52 90 top
R6  52.96,58.55 90 top
R7  11.37,77.47 270 top
R8  30.08,30.54 270 top
R9  33.28,36.29 270 top
R10  7.54,15.56 90 top
R11  19.14,35.87 270 top
R12  26.1,65.06 0 top
R13  6.54,33.02 0 top
R14  59.94,73.19 0 top
R15  36.4,31.82 270 top
R16  58.76,69.55 0 top
R17  34.77,34.24 270 top
R18  49.28,66.93 0 top
R19  47.5,66.93 0 top
R20  11.58,37.34 180 top
R21  82R  [R0603']  15.22,27.64 180 top
R22  10.63,15.6 270 top
R23  82R  [R0603']  18.29,31.96 180 top
R24  51R  [R0603']  18.84,28.02 90 top
R25  38.6,53.22 270 top
R26  36.77,29.4 270 top
R33  6.6,64.64 0 top
R34  8.38,64.64 180 top
R37  28.02,64.56 180 top
R38  38.63,51.46 270 top
R39  65.85,10.85 0 top
R40  69.36,10.85 0 top
R41  44.95,9.59 270 top
R42  41.43,11.45 180 top
R43  41.43,9.03 0 top
R44  41.41,6.32 180 top
R45  41.45,1.6 0 top
R47  59.95,4.84 180 top
RELOAD  2.35,31.37 90 top
RESET  2.41,39.05 90 top
SD1  28.91,13.91 270 top
U1  7.12,8.47 0 top
U2  13.46,67.44 180 top
U3  42.02,42.63 180 top
U4  54.17,67.37 180 top
U5  40.64,60.52 180 top
U6  20.83,77.85 180 top
U7  12.57,52.13 90 top
U8  12.91,37.53 0 top
U9  12.04,32.19 180 top
U10  51.36,6.38 270 top
U13  53.74,41.43 270 top
U$22  65.2,5.45 270 top
USB1  5.71,79.27 180 top
USB2  2.92,23.24 270 top
Y1  2.03,72.47 90 top

### Tracks (layer width: path | path; a pad name or v marks a point on that pad's centre or on a via)
1PPS  (via drill 0.35)
  Top 0.254: U5.4 32.94,61.62 27.43,56.1 v27.43,51.1
  Top 0.305: v21.25,51.18 20.57,51.18 16.76,47.37 14.14,47.37 12.65,45.89 U7.5
  Bottom 0.254: v27.43,51.1 21.33,51.1 v21.25,51.18
3.3V  (via drill 0.35)  (1 unrouted)
  Top 0.152: U$22.4 67.39,2.81 67.49,2.71 69.68,2.71 C36.1
  Top 0.254: v13.79,68.91 v13.78,68.9 | v35.45,35.4 35.22,35.4 R17.2 | v35.73,41.03 35.98,41.03 36.45,40.56 C6.2 | v9.64,13.32 9.92,13.32 R22.2 | U1.5 8.82,8.73 v8.9,8.73 | U10.25 53.77,2.91 53.77,3.74 53.93,3.91 55.29,3.91 55.45,3.74 55.45,2.91 U10.28 | J8.A1 69.38,26.06 68.38,25.06 68.38,24.68 66.47,22.78 | 66.47,22.78 66.25,23 64.13,23 63.38,23.75 50.48,23.75 42.99,31.24 | 66.47,22.78 69.38,19.87 J8.A2 | R26.2 35.37,29.4 v34.99,29.78 | v34.77,31.67 34.93,31.82 R15.2 | v32.66,37.58 32.66,36.38 R9.2 | 27.2,16.41 C13.2 27.2,16.21 27.86,15.56 | 28.68,16.57 C22.2 28.68,16.38 27.86,15.56 | R13.2 6.54,31.46 v6.48,31.39 | R4.2 6.6,36.03 v6.73,35.9 | SD1.4 27.86,15.56
  Top 0.305: C23.2 19.71,39.7 U8.8
  Top 0.508: 32.09,58.46 v32.09,58.63 | U5.8 34.1,57.22 C16.2 | C16.2 33.27,57.28 32.09,58.46 | 32.09,58.46 32,58.55 32,51.69 | 8.89,43.59 U7.2 | 32,51.69 32,51.33 | 32,51.33 32,50.76 | v32.17,47.79 32,47.96 32,50.76 | v12.19,80.9 4.+ | C16.2 C14.2 34.54,55.75 34.9,56.12 U5.9 | 32,51.33 3.3V.TP | 3.3V.TP 33.12,51.33 32.76,51.69 32,51.69 | 3.3V.TP 33.19,51.31 33.19,50.76 32,50.76 | v13.79,68.91 U2.5 13.83,71.11 13.83,71.98 14.07,72.22 18.43,72.22 C21.1 18.9,72.7 18.9,71.94 19.59,71.25 23.62,71.25 | v15.75,65.85 U2.19 | v32,67.94 28.7,71.25 23.62,71.25 | 23.62,71.25 C20.2 | v28.53,39.06 28.53,38.99 28.72,38.8 28.72,31.18 R8.2 | 27.2,16.45 C13.2 | C23.2 19.49,38.35 | R22.2 9.88,15.56 R10.2 | U10.19 50.1,2.41 v50.1,0.7 50.1,2.49 U10.20 | U10.15 46.41,3.49 v45.02,3.49 44.69,3.83 L4.2 | v56.64,2.41 55.88,2.41 55.58,2.71 U10.28 | v66.93,0.83 66.93,2.35 67.39,2.81 | v28,12.72 27.88,12.85 27.88,13.88 | v17.91,40.41 18.04,40.28 U8.8 | v8.89,45.17 8.76,45.05 C7.2 8.7,41.72 C17.2 8.83,40.13 v8.83,39.78
  Top 0.61: v8.89,45.17 8.89,43.59
  Top 0.635: SD1.4 27.88,13.88 27.88,12.85 28.41,12.32 31.69,12.32 33.78,14.41
  Top 0.762: C25.2 42.02,37.39 U3.TER | C25.2 42.29,37.66 42.99,37.66 | C25.2 42.39,37.76 42.39,39.08
  Top 1.016: U3.2 U3.TER | U3.TER 41.34,38.78 38.04,38.78 37.15,39.67 C6.2 36.26,40.56 35.92,40.89 35.89,40.89 32.85,43.93 v32.85,44.41 | U3.TER 42.39,39.08 42.99,38.48 42.99,37.66 42.99,31.24 v42.99,23.75 | v39.31,19.94 33.78,14.41 33.34,13.97 33.34,9.65 v36.01,6.98
  Bottom 0.152: v12.19,80.9
  Bottom 0.254: 35.63,35.57 35.63,32.59 34.77,31.73 v34.77,31.67 35.03,31.42 35.03,29.82 v34.99,29.78 | 34.17,38.4 34.17,38 35.63,36.54 35.63,35.57 | v35.73,41.03 35.73,39.96 34.17,38.4 | 35.63,35.57 v35.45,35.4 | C2.2 8.9,6.86 v8.9,8.73 7.35,10.27 7.35,11.99 8.69,13.32 v9.64,13.32 10.53,13.32 11.5,12.34 27.62,12.34 v28,12.72 | 34.17,38.4 33.34,37.58 v32.66,37.58 | 8.91,39.83 8.91,39.54 6.73,37.36 v6.73,35.9 6.73,31.65 v6.48,31.39 | v17.91,40.41 8.93,40.41 8.91,40.39
  Bottom 0.508: v32.09,58.63 32.09,67.86 v32,67.94 32,72.77 23.88,80.9 v12.19,80.9 | 8.89,40.77 8.91,40.75 8.91,40.39 | v12.19,80.9 | v15.75,65.85 13.78,67.82 v13.78,68.9 | v32.85,44.41 32.85,43.48 28.53,39.16 v28.53,39.06 | v36.01,6.98 41.53,6.98 v45.02,3.49 47.88,0.64 50.04,0.64 v50.1,0.7 50.16,0.64 56.64,0.64 | 56.64,0.64 66.74,0.64 v66.93,0.83 66.99,0.83 | v56.64,2.41 56.64,0.64
  Bottom 1.016: v32.85,44.41 32.85,47.12 v32.17,47.79 32.11,47.86 11.36,47.86 8.91,45.4 8.91,40.39 8.91,39.83 8.83,39.91 | v42.99,23.75 42.99,23.69 39.31,20 v39.31,19.94
5.0V  (via drill 0.35)
  Top 0.254: Q5.2 22.06,33.55 23.47,33.55 v23.64,33.38
  Top 0.508: v30.73,58.55 30.73,51.95 | 30.73,50.68 30.73,44.58 30.9,44.75 | v30.9,43.31 | v30.9,43.31 30.9,44.75 | v30.73,70.74 27.18,74.3 17.44,74.3 | 30.9,44.75 33.53,47.37 C1.2 37.4,47.37 38.97,45.8 U3.3 | 15.66,74.3 17.44,74.3 | 15.66,74.3 14.14,74.3 | 14.14,74.3 C24.2 10.2,74.3 L3.2 | 30.73,51.95 30.06,51.27 5.0V.TP 30.14,51.27 30.73,50.68 | 30.73,51.95 30.73,50.68 | 17.44,74.3 16.45,75.28 U6.5V | C28.2 15.11,74.84 15.66,74.3 | C27.2 13.59,74.84 14.14,74.3 | v25.78,32.83 25.78,30.66 19.75,24.64 L5.1 10.35,22.86 C8.2
  Top 0.762: U3.3 39.73,46.05 41.94,48.26 | 41.94,48.26 U13.2 U13.1 44.48,50.8 41.94,48.26
  Bottom 0.508: v30.73,70.74 30.82,70.65 30.82,58.63 v30.73,58.55 | v30.9,43.31 30.9,43.07 25.48,37.66 25.48,33.38 v23.64,33.38 25.23,33.38 v25.78,32.83
ANTON
  Top 0.305: U5.13 49.93,59.42 50.8,58.55 R6.1
DTR
  Top 0.254: R3.1 21.13,69.01 20.95,68.83 Q2.2 20.83,68.07 20.83,67.44 20.32,66.93 17.27,66.93 17.23,66.89 15.26,66.89 13.38,65.01 13.14,64.76 U2.15
ESP-RXD  (via drill 0.35)
  Top 0.254: R38.2 37.06,51.46 v36.66,51.86 | v21.25,51.99 20.58,52.66 20.58,55 19.57,56.01 9.23,56.01 8.84,56.39 U7.37
  Bottom 0.254: v36.66,51.86 36.57,51.95 21.29,51.95 v21.25,51.99
ESP-TXD  (via drill 0.35)
  Top 0.254: R25.2 | R25.2 37.08,53.22 v36.66,52.79 | v21.25,52.88 21.25,54.91 19.74,56.42 10.5,56.42 10.11,56.8 U7.36
  Bottom 0.254: v36.66,52.79 36.57,52.71 21.42,52.71 v21.25,52.88
ETH_LED1
  Top 0.152: R39.2 66.7,14.11 69.34,16.75 69.85,16.75 70.48,17.38 70.48,22.67 J8.C1
ETH_LED2
  Top 0.152: R40.2 70.21,14.56 J8.C2
ETH_OSC1
  Top 0.152: U10.23 52.33,2.01 53.39,0.96 60.81,0.96 62.76,2.91 U$22.3
ETH_OSC2
  Top 0.152: U10.24 52.91,2.84 52.91,3.47 53.76,4.31 59.77,4.31 R47.1
ETH_TPIN+
  Top 0.152: J8.4 64.52,18.91 60.78,18.91 59.9,18.03 59.9,14.64 60.52,14.03 60.52,10.22 57.98,7.68 49.28,7.68 47.7,9.26 47.78,9.35 U10.13 47.6,9.8 47.6,9.03 47.47,8.9 46.41,8.9 45.8,9.51 44.17,9.51 43.69,9.03 R43.2
ETH_TPIN-
  Top 0.152: J8.5 61.63,20.22 59.6,18.19 59.6,16.37 arc-90 59.33,16.1 58.17,16.1 arc90 57.91,15.84 57.91,15.77 arc90 58.17,15.51 59.33,15.51 arc-90 59.6,15.24 59.6,14.51 60.21,13.89 60.21,10.35 57.85,7.99 49.41,7.99 48.43,8.96 U10.12 48.25,10.16 48.25,10.93 47.73,11.45 R42.1
ETH_TPOUT+
  Top 0.152: J8.1 62.77,14.39 62.77,12.76 arc-90 62.5,12.5 61.91,12.5 arc90 61.65,12.23 61.65,12.21 arc90 61.91,11.95 63.55,11.95 arc-90 63.82,11.68 63.82,11.66 arc-90 63.55,11.4 61.91,11.4 arc90 61.65,11.13 61.65,11.11 arc90 61.98,10.78 61.99,10.78 arc-90 62.51,10.26 62.51,9.87 57.77,5.12 49.83,5.12 48.43,3.72 U10.17 48.44,2.02 48.02,1.6 R45.2
ETH_TPOUT-
  Top 0.152: J8.3 60.97,16.64 60.97,14.67 61.54,14.1 61.98,14.1 62.46,13.61 62.46,13.07 arc-90 62.22,12.83 61.78,12.83 arc90 61.28,12.32 61.28,11.05 arc90 61.85,10.48 61.91,10.48 arc-90 62.2,10.19 62.2,9.99 57.64,5.43 49.67,5.43 47.78,3.53 U10.16 47.78,3.54 45,6.32 R44.1
ETH_VC1+
  Top 0.254: J8.8 65.82,25.3 65.82,27.02 70.12,31.32 70.12,41.54 D10.C 68.81,41.9 D9.A
ETH_VC1-
  Top 0.305: J8.9 62.01,25.93 64.13,28.05 64.13,28.28 68.81,32.95 D16.C 68.81,34.73 D15.A
ETH_VC2+
  Top 0.254: J8.10 64.55,27.2 69.59,32.24 69.59,37.92 D11.C 68.81,38.35 D12.A
ETH_VC2-
  Top 0.254: J8.11 67.09,25.74 68.53,27.18 68.53,28.51 70.66,30.64 70.66,44.12 69.74,45.03 D14.C 68.81,45.46 D13.A
GND  (via drill 0.35, 0.51 pad 1.02)  (6 unrouted)
  Top 0.152: U$22.2 63.1,7.87 60.77,5.55 R47.2 | 57.6,11.16 C33.2
  Top 0.254: U1.2 U1.7 | U1.2 | U1.2 v5.42,8.73 | v27.94,19.43 27.94,18.86 | 27.94,18.86 C13.1 | 27.94,18.86 28.66,18.14 C22.1 | U10.11 49.22,9.85 49.22,9.01 49.38,8.85 49.76,8.85 v49.98,8.64 | U10.18 49.08,3.61 49.7,4.22 50.13,4.22 v50.17,4.25 50.23,4.19 50.45,4.19 50.96,3.68 | U10.21 51.03,3.61 50.96,3.68 | U10.22 50.96,3.49 50.96,3.68 | C33.2 57.67,12.07 J8.S2 | U10.2 55.07,10.11 55.07,10.95 55.28,11.16 57.6,11.16 | SD1.G3 36.76,5.32 v37.02,5.59 38.2,5.59 C34.1 | C35.1 38.34,8.51 v37.27,8.51 | v36.51,14.61 35.86,13.95 SD1.G4 | v25.53,15.56 25.53,14.04 SD1.6 | v20.83,14.67 20.83,13.53 SD1.G1 | v20.83,1.91 20.83,3.58 SD1.G2 | C36.2 69.69,5.3 v70.11,5.72 | v63.5,9.72 63.5,8.39 U$22.2 | C25.1 40.3,36.06 v40.3,35.2 | C26.1 9.53,37.38 v10.2,38.06 | v17.78,26.35 17.78,26.5 18.46,27.17 R24.1 | v24.07,32.19 23.86,31.98 Q1.2 | C3.1 4.62,36.55 RESET.1 | C4.1 2.35,29.91 RELOAD.1 | USB2.5 5.76,21.91 v4.64,21.91 | GND.TP
  Top 0.305: U2.8 11.84,69.53 v11.87,69.53 | U2.20 v16.39,62.36 v16.38,62.36 | USB1.5 4.42,77.5 v4.45,77.53 | v20.38,39.94 21.23,39.1 C23.1
  Top 0.406: U8.4 13.64,37.18 v13.8,37.02
  Top 0.508: ANT1.3 38.86,79.82 38.86,81.01 38.72,81.16 32.01,81.16 32,81.15 v31.24,81.15 | ANT1.2 44.96,79.5 44.96,81.15 46.2,81.15 46.2,81.16 47.22,81.16 47.22,81.15 v48.01,81.15 | U7.38 7.57,59.25 v7.56,59.25 | U7.1 7.56,43.63 v7.56,45.21 | U7.15 25.57,46.33 v26.56,46.33 | v6.22,40.2 6.29,40.26 C17.1 | C7.1 7.11,41.91 | C22.1 28.6,18.06 | v43.16,45.8 U3.1 v45.45,45.8 | v37.02,49 36.07,49 35.98,48.91 35.95,48.89 C1.1 | C28.1 C27.1 v13.59,77.98 | v17.72,75.63 17.7,75.63 U6.GND 17.7,78.42 v17.72,78.42 | USB1.P2 4.51,78.74 v5.02,78.74 | USB1.P1 6.92,79.63 v7.37,79.63 | C21.2 v21.84,72.77 | C20.1 v26.42,72.52 | C18.1 v4.57,72.6 C19.1 | U7.P$1 15.25,52.45 v14.73,52.45 | C24.1 12.07,75.87 R7.1 12.07,78.86 v12.06,78.87 | R21.1 16.07,27.26 v16.89,26.44 | v12.66,36.51 11.7,36.51 R20.1 | R11.1 19.85,37 v20.08,37.23 | v37.7,42.86 37.15,42.31 C6.1 | v44.96,7.56 v44.95,7.56 R41.2 | v10.48,20.19 10.48,20.76 10.38,20.86 10.48,20.95 C8.1
  Top 0.61: GND.TP v37.08,44.75 | GND.TP v35.73,43.4 | GND.TP v34.37,44.75 | GND.TP v35.73,46.1
  Top 0.762: v46.72,35.9 46.73,35.88 U13.3 46.76,34.57 | v49.38,34.57 46.76,34.57 | v44.24,34.57 46.76,34.57 | C17.1 7.18,41.72 C7.1 7.24,43.3 U7.1
  Bottom 0.254: C2.1 5.42,6.79 v5.42,8.73 6.95,10.25 6.95,12.31 8.61,13.97 20.13,13.97 v20.83,14.67
  other vias: 40.75,41.36 39.48,41.36 39.48,42.63 40.75,42.63 40.75,43.9 39.48,43.9 43.29,43.9 43.29,42.63 43.29,41.36 44.56,41.36 44.56,42.63 44.56,43.9 17.78,51.94 17.78,52.96 17.78,53.98 17.78,54.99 17.78,49.91 17.78,50.93 16.76,50.42 16.76,51.44 16.76,52.45 16.76,53.47 16.76,54.48 15.75,54.99 15.75,53.98 15.75,52.96 15.75,51.94 15.75,50.93 15.75,49.91 14.73,50.42 14.73,51.44 14.73,53.47 14.73,54.48 13.72,54.99 13.72,53.98 13.72,52.96 13.72,51.94 13.72,50.93 13.72,49.91 12.7,50.42 12.7,51.44 12.7,52.45 12.7,53.47 12.7,54.48 2.1,79.44 2.1,78.93 9.33,78.93 9.33,79.5 40.89,73.28 55.37,69.21 42.42,69.21 46.23,74.04 51.05,74.04 52.58,74.04 54.1,74.04 40.89,74.55 40.89,71.75 40.89,70.48 40.89,69.21 44.45,74.04 49.53,74.04 55.37,72.77 55.37,70.99 45.47,69.21 43.94,69.21 48.01,74.04 56.01,67.69 56.01,65.91 52.58,67.94 52.58,66.67 46.99,69.21 48.51,69.21 50.04,69.21 51.56,69.21 48.01,79.63 48.01,78.36 48.01,76.83 48.01,75.31 39.37,74.55 37.85,74.55 36.32,74.55 34.8,74.55 33.27,74.55 32,74.55 31.24,79.88 31.24,78.61 31.24,77.09 31.24,75.56 56.01,64.39 56.01,62.87 56.01,61.09 56.01,59.56 56.01,58.04 55.24,57.09 54.23,56.26 52.7,56.26 51.18,56.26 49.66,56.26 48.32,56.26 49.66,58.1 48.32,58.1 47.05,58.1 47.05,56.26 4.06,79.69 6.48,78.74 2.6,22.48 3.17,21.72 2.48,24.83 3.37,24.07
  pour Top (isolate 0.305): 30.48,81.91 30.48,65.41 56.52,65.41 56.52,81.91
  pour Top: 56.52,65.41 56.52,54.48 30.48,54.48 30.48,65.41
  pour Bottom: 0,82.04 71.18,82.04 71.18,-1.27 20.57,-1.27 20.57,11.3 13.08,18.8 0,18.8
GPIO0
  Top 0.254: Q2.3 20.32,70.49 24.38,70.49 24.89,69.98 24.89,64.56 | 24.89,64.56 24.89,62.86 24.08,62.06 U7.25 | R12.1 24.89,64.56
LEDA
  Top 0.152: U10.27 54.93,2.01 55.25,1.7 59.04,1.7 63.51,6.17 64.25,6.17 65,6.92 R39.1
LEDB
  Top 0.152: U10.26 54.28,2.01 54.91,1.39 59.16,1.39 63.63,5.86 64.37,5.86 65.3,6.79 65.3,8.33 66.15,9.17 66.83,9.17 R40.1
MICS_PREHEAT_NOX
  Top 0.254: 16.42,43.59 16.42,43.37 19.06,40.73 20.97,40.73 24.8,36.9 24.8,31.85 Q1.1
  Top 0.305: 16.42,43.59 U7.8
MICS_PWR  (via drill 0.35)
  Top 0.254: U7.9 18.27,43.09 18.27,42.47 19.22,41.53 v19.37,41.53 | v21.53,37.08 21.8,36.81 Q5.1
  Bottom 0.254: v19.37,41.53 20.38,41.53 21.53,40.39 v21.53,37.08
N$1
  Top 0.254: R16.1 58.76,71.5 51.39,78.87 2.+
N$2
  Top 0.254: R21.2 14.08,27.64 13.31,28.41 U9.C
N$3
  Top 0.305: C5.2 C11.2 C9.1
N$4
  Top 0.305: C9.2 C10.2 ANT1.1
N$5
  Top 0.305: U4.3 53.68,67.87 L1.2 L2.P$1
N$6
  Top 0.254: U9.A 10.77,30.35 12.82,32.39 17.01,32.39 R23.2
N$7
  Top 0.254: 1.+ 57.63,73.9 R14.1
N$8
  Top 0.305: L2.P$2 C5.1
N$9
  Top 0.305: U4.5 54.17,65.85 54.61,65.41 54.61,59.49 R6.2
N$10
  Top 0.305: U4.4 53.66,66.87 C15.2 C12.2 53.66,60.52 R5.2
N$11
  Top 0.254: R18.2 49.28,64.39 47.6,62.72 U5.16
N$12
  Top 0.254: Q3.1 23.71,65.79 R3.2
N$13  (via drill 0.35)
  Top 0.254: Q2.1 18.29,68.2 v17.78,67.69 | v17.53,64.64 18.23,63.94 R1.2
  Bottom 0.254: v17.78,67.69 17.53,67.44 v17.53,64.64
N$14
  Top 0.254: R19.2 47.5,64.9 46.42,63.82 U5.17
N$19  (via drill 3.07)
  other vias: 14.61,6.35
N$20  (via drill 3.07)
  other vias: 67.31,78.1
N$22
  Top 0.254: 3.+ 53.83,74.65 54.36,74.65 57.4,71.6 R2.1
N$23
  Top 0.254: R23.1 19.14,31.87 19.92,31.09 Q1.3
  Top 0.305: Q1.3 21.06,31.09 R24.2
N$24
  Top 0.254: C26.2 9.25,35.29 9.04,35.2 9.04,33.91 U9.J 9.77,34.64 U9.H
  Top 0.305: Q5.3 23.77,34.63 13.33,34.63 U9.F U9.G U9.H
N$25
  Top 0.508: R7.2 10.67,77.48 4.-
N$26  (via drill 0.35)
  Top 0.305: U2.7 12.51,71.08 12.48,71.12 v12.48,72.3 | USB1.2 6.37,77.11 6.76,77.5 8.54,77.5 9.1,76.94 9.1,75.95 v9.14,75.9
  Bottom 0.305: v9.14,75.9 9.14,75.05 11.9,72.3 v12.48,72.3
N$27  (via drill 0.35)
  Top 0.305: v13.14,73.02 13.14,71.58 U2.6 | USB1.3 5.71,77.22 6.45,77.96 8.73,77.96 9.78,76.91 v9.78,75.4
  Bottom 0.305: v13.14,73.02 12.06,73.02 v9.78,75.4
N$28
  Top 0.254: U2.9 11.19,72 10.41,72.77 7.62,72.77 6.77,73.62 | 6.77,73.62 | 6.77,73.62 6.71,73.68 C18.2 6.1,74.21 5.67,74.63 Y1.2
N$29
  Top 0.254: U2.10 10.54,71.89 10.16,72.26 7.62,72.26 6.86,71.5 6.12,71.5 | 6.12,71.5 C19.2 | Y1.1 5.59,70.32 6.12,70.85 6.12,71.5
N$30
  Top 0.254: U2.3 15.09,68.05 12.39,65.35 R34.2
N$33
  Top 0.254: U7.35 11.38,61.39 10.92,61.85 7.37,61.85 6.6,62.61 R33.2
N$36  (via drill 0.35)
  Top 0.254: U6.TXD 21.45,75.79 v21.5,75.73 | R37.2 28.02,66.5 v27.01,67.52
  Bottom 0.254: v21.5,75.73 25.21,75.73 27.08,73.87 27.08,67.6 v27.01,67.52
N$43
  Top 0.152: R43.1 39.34,10.17 C35.2 39.2,10.17 R42.2
N$46  (via drill 0.35)
  Top 0.152: R44.2 40.56,6.22 L4.1 40.56,1.67 R45.1 40.19,1.6 C34.2 38.7,3.81 40.01,5.12 40.01,5.88 R44.2
  Top 0.254: R44.2 38.88,7.9 37.02,7.9 36.67,8.26 36.67,8.35 36.51,8.51 36.67,8.66 36.67,9.58 39.62,12.53 40.53,12.53 v43.75,15.75 | v47.12,18.99 58.12,18.86 60.95,21.69 63.84,21.69 65.84,19.69 65.84,17.82 64.55,16.54 J8.2
  Bottom 0.254: v47.12,18.99 47.05,18.92 v43.75,15.75
PHY_SPI_CS_IO16  (via drill 0.35)
  Top 0.254: U7.27 21.54,60.46 22.77,59.23 22.77,46.47 24.22,45.03 27.23,45.03 32.64,39.61 v32.64,39.5 | U10.9 50.38,10.82 38.23,22.97 38.23,28.69 37.52,29.4 R26.1 37.47,29.58 36.35,30.7 34.38,30.7 31.05,34.03 31.05,37.59 v30.86,37.78
  Bottom 0.254: v32.64,39.5 32.58,39.5 v30.86,37.78
PHY_SPI_INT_IO25  (via drill 0.35)
  Top 0.254: U7.10 19.54,44.17 19.54,44.35 19.77,44.58 26.43,44.58 26.43,44.56 26.69,44.31 v26.94,44.31 | v31.66,44.33 32.06,43.93 32.06,42.85 37.54,37.37 37.54,36.76 41.02,33.27 41.02,23.43 53.63,10.82 U10.4
  Bottom 0.254: v26.94,44.31 27.7,44.31 28.61,45.22 29.38,45.22 30.27,44.33 v31.66,44.33
PM_RESET  (via drill 0.35)
  Top 0.254: U6.RESET v22.7,75.13 | R12.2 25.98,64.24 25.98,60.34 | 25.98,60.34 25.98,58.63 25.47,58.12 U7.24 | v25.57,60.75 25.98,60.34
  Bottom 0.254: v22.7,75.13 22.7,63.61 v25.57,60.75
PM_SET  (via drill 0.35)
  Top 0.254: U6.SET 18.95,75.83 v18.96,75.82 | U7.26 22.77,60.68 22.86,60.68 22.86,60.92 20.66,63.12 v20.66,63.88
  Bottom 0.254: v20.66,63.88 20.66,74.13 v18.96,75.82
POE_VIN+
  Top 0.762: D13.C D9.C | D9.C | D9.C D12.C D15.C | D15.C 61.08,32.05 U13.5 | U13.6 63.62,34.59 D15.C
POE_VIN-
  Top 0.508: D11.A D10.A 66.5,41.78 D14.A
  Top 0.762: D16.A D11.A 66.5,41.78 | D10.A D14.A | D14.A | D14.A 66.5,48.86 65.56,49.81 | U13.8 64.56,50.8 65.56,49.81 | U13.7 64.01,48.26 65.56,49.81
RBIAS
  Top 0.152: U10.14 45.41,9.98 R41.1
RELOAD
  Top 0.254: U7.4 11.38,40.21 9.7,38.53 8.56,38.53 8.09,38.06 8.09,35.26 6.56,33.73 R13.1 4.64,33.73 C4.2 4.32,33.91 2.39,33.91 RELOAD.2
RESET  (via drill 0.35)
  Top 0.254: v10.03,55.12 10.03,43.71 U7.3 10.11,39.77 9.28,38.93 7.56,38.93 R4.1 4.93,37.98 C3.2 4.63,37.88 2.41,40.09 RESET.2 | 22.77,63.63 22.77,62.27 v22.77,62.19 | 22.77,63.63 | Q3.3 22.77,63.63
  Bottom 0.254: v10.03,55.12 10.03,56.39 13.97,60.33 21.08,60.33 22.77,62.02 v22.77,62.19
RF_IN
  Top 0.305: U4.6 54.67,66.11 55.12,65.66 55.12,58.29 54.04,57.22 U5.11
RTS
  Top 0.254: U2.16 13.79,64.84 15.43,66.48 18.17,66.48 R1.1 20.26,65.35 20.66,65.75 Q3.2
RXD0
  Top 0.254: U7.34 12.65,61.64 11.94,62.36 8.89,62.36 8.38,62.86 R34.1
SCL
  Top 0.254: U7.12 22.08,43.09 22.08,42.71 27.75,37.04 27.75,29.54 13.81,15.6 R22.1 10.62,14.89 10.62,13.32 10,12.7 7.81,12.7 7.43,12.32 7.43,10.59 U1.6
SD_SPI_CS_IO5  (via drill 0.35)
  Top 0.254: U7.29 19.54,60.09 19.54,59.66 20.73,58.48 21.59,58.48 22.27,57.8 v22.27,45.68 | v23.92,41.87 24.41,41.38 27.51,41.38 29.9,38.99 29.9,34.24 30.79,33.35 R8.1 30.79,25.39 29.25,23.85 v29.25,23.77 | v31.22,21.81 30.06,20.64 SD1.2
  Bottom 0.254: v23.92,41.87 23.47,42.32 23.47,45.17 22.9,45.74 22.33,45.74 v22.27,45.68 | v29.25,23.77 v31.22,21.81
SDA
  Top 0.254: U1.1 6.86,10.64 6.86,15.56 R10.1 8.19,16.92 13.68,16.92 27.05,30.29 27.05,36.68 20.81,42.92 20.81,43.09 U7.11
SPI_CLK_IO14  (via drill 0.35)
  Top 0.254: U10.8 51.12,10.07 51.09,10.09 51.09,10.76 38.88,22.96 38.88,24.11 | 38.88,24.83 38.88,30.05 R15.1 37.11,32.39 36.5,33 33.38,33 31.78,34.61 31.78,37.89 27.06,42.61 | 38.88,24.83 38.88,24.11 | 38.88,24.11 v38.86,24.13 38.86,24.81 38.88,24.83 | SD1.5 26.76,15.12 26.16,15.72 26.16,18.51 31.78,24.13 v36.45,24.13
  Top 0.305: U7.13 22.81,42.93 23.14,42.61 27.06,42.61
  Bottom 0.254: v38.86,24.13 v36.45,24.13
SPI_MISO_IO12  (via drill 0.35)
  Top 0.254: 34.02,36.32 R9.1 | 34.02,36.32 36.74,36.32 40.26,32.8 v40.26,26.23 40.26,22.89 52.33,10.82 U10.6 | SD1.7 24.58,13.93 24.58,17.88 32.99,26.29 v37.53,26.29 | U7.14 26.06,43.63 26.56,43.13 27.8,43.13 32.62,38.31 33.16,38.31 34.02,37.46 34.02,36.32
  Bottom 0.254: v40.26,26.23 37.59,26.23 v37.53,26.29
SPI_MOSI_IO15  (via drill 0.35)
  Top 0.254: U7.23 25.42,56.65 25.35,56.65 24.42,55.72 24.42,45.95 24.93,45.45 27.9,45.45 35.59,37.77 v36.04,37.77 | v36.68,35.08 36.32,35.08 R17.1 35.63,34.39 37.02,34.39 39.5,31.91 v39.5,25.21 39.5,22.99 51.37,11.11 51.39,11.11 51.68,10.82 U10.7 | v37.47,25.21 37.47,23.94 36.77,23.24 31.75,23.24 29.41,20.9 29.41,16.12 28.96,15.67 SD1.3
  Bottom 0.254: v36.04,37.77 36.36,37.45 36.36,35.4 v36.68,35.08 | v39.5,25.21 v37.47,25.21
STAT_LED1  (via drill 0.35)
  Top 0.254: v59.94,58.04 59.27,58.72 59.27,66.98 59.94,67.66 R14.2 | U7.33 13.92,59.61 16.68,56.86 20.23,56.86 v21.33,55.76
  Bottom 0.254: v59.94,58.04 55.46,53.55 23.54,53.55 v21.33,55.76
STAT_LED2  (via drill 0.35)
  Top 0.254: v58.76,58.04 R16.2 | U7.31 16.46,59.19 18.29,57.36 20.74,57.36 v21.33,56.77
  Bottom 0.254: v58.76,58.04 58.51,58.04 54.7,54.23 23.88,54.23 v21.33,56.77
STAT_LED3  (via drill 0.35)
  Top 0.254: v57.4,58.04 R2.2 | U7.30 17.73,58.85 18.71,57.87 v21.33,57.87
  Bottom 0.254: v57.4,58.04 54.36,54.99 24.21,54.99 v21.33,57.87
TXD0
  Top 0.254: U2.4 14.44,68.41 12.7,66.68 7.11,66.68 6.6,66.17 R33.1
U1RXD  (via drill 0.35)
  Top 0.152: 39.26,62.72 v39.28,62.7 | 39.28,53.25 R25.1
  Top 0.254: U5.3 39.26,62.72 | v39.28,56.35 39.28,53.25
  Bottom 0.254: v39.28,62.7 v39.28,56.35
U1TXD  (via drill 0.35)
  Top 0.152: 40.54,63.81 v40.55,63.8
  Top 0.254: U5.2 35.54,63.81 40.54,63.81 | R38.1 40.55,52.67 v40.55,56.35
  Bottom 0.254: v40.55,63.8 v40.55,56.35
U2RXD
  Top 0.254: U7.16 25.55,47.78 26.16,47.78 26.68,48.3 26.68,62.51 R37.1
V_BCKP
  Top 0.254: BAT1.+2 BAT1.+1
  Top 0.508: U5.6 41.91,59.42 41.91,54.23 58.74,54.23 63.12,58.61 BAT1.+1
VBUS  (1 unrouted)
  Top 0.305: USB1.1 7.01,74.73 7.62,74.13 L3.1
  Top 0.508: USB2.1 5.86,24.61 6.09,24.61 6.12,24.64 L5.2
VCAP
  Top 0.254: U10.1 55.93,9.63 57.42,9.63 C33.1
VCC_RF
  Top 0.305: U5.14 R5.1
VOX_RAWA  (via drill 0.35)
  Top 0.254: R20.2 11.94,38.4 U8.3 13.72,38.32 15.87,38.32 16.07,38.13 v16.07,36.07 | U9.B 12.04,30.2 12.03,30.21 13.51,31.69 v14.1,31.69
  Bottom 0.254: v14.1,31.69 14.35,31.94 14.35,32.89 15.49,34.04 15.49,35.5 v16.07,36.07
VOX_RAWB
  Top 0.254: U7.6 13.89,43.6 13.89,39.96 U8.1 U8.2
VRED_RAWA  (via drill 0.35)
  Top 0.254: R11.2 17.83,35.87 v17.4,35.43 | v16.07,31.69 15.49,31.12 U9.D
  Top 0.305: R11.2 18.04,36.26 U8.5
  Bottom 0.254: v17.4,35.43 17.34,35.43 16.95,35.05 16.95,33.72 16.07,32.83 v16.07,31.69
VRED_RAWB
  Top 0.254: U7.7 15.73,43.09 15.73,42.54 16.38,41.89 16.38,39.94
  Top 0.305: U8.7 U8.6 17.92,38.4 16.38,39.94
(copper drawn outside any net)
  shapes: Top area x3

### Text on the board
bPlace: AirU PoE v1.0 / 11/18/19 | Support from: | Designed By: Henry Gilbert / With support from the AirU Team | Laboratory for Nano-Integrated Systems